# EAGLE schematic embedded-gw (EAGLE 9.6.2)
AUTHOR: Neal Jackson; REV: B; TITLE: Embedded GW

## Sheet 1 of 3
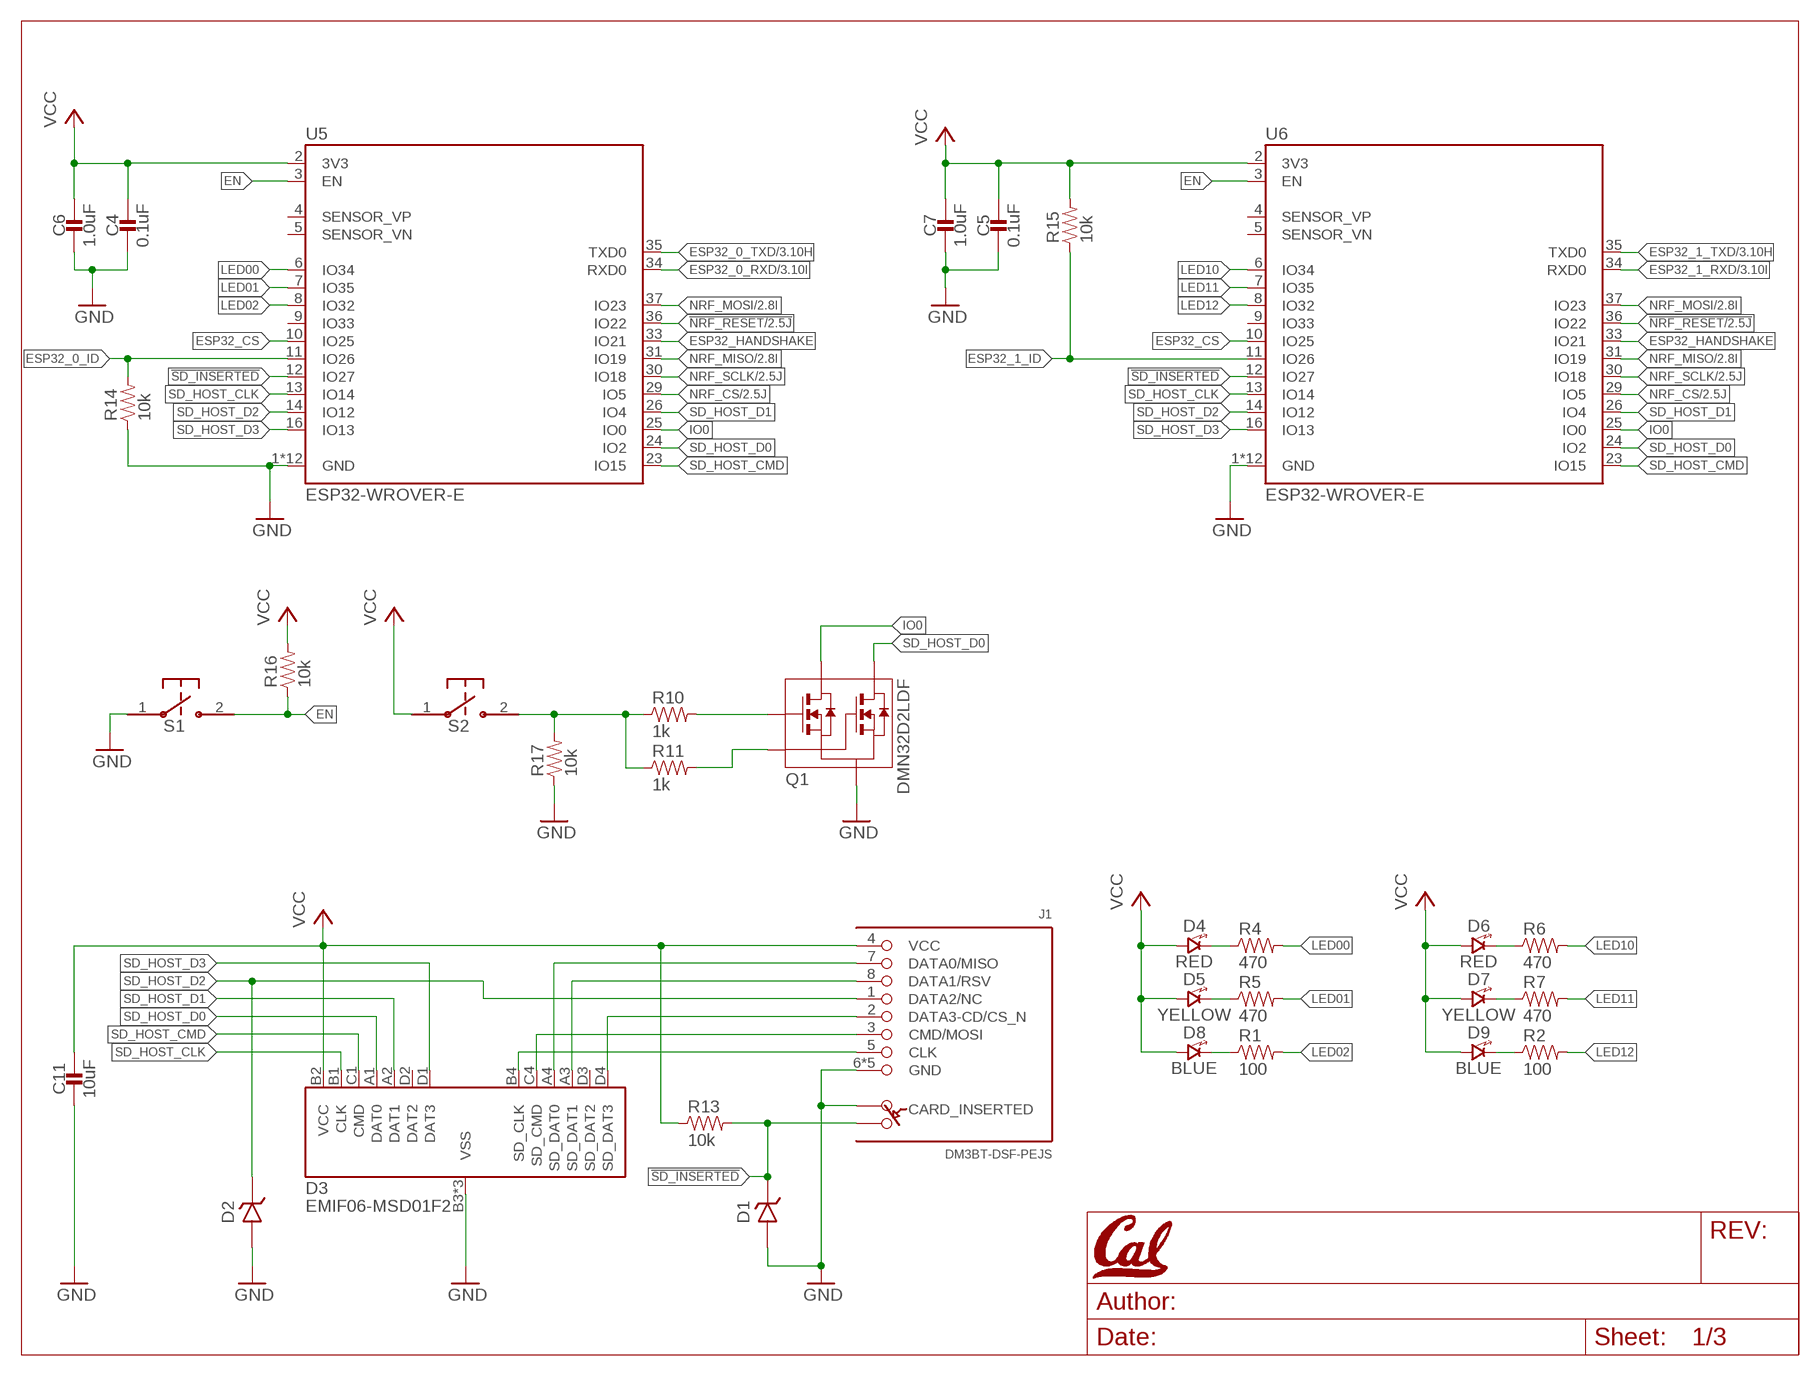
[diagram p0: schematic, sheet 1]
U$1 (LETTER_L_CAL): HEIGHT: 8.5in; WIDTH: 11in

### Parts
C4  0.1uF  CAPACITOR0402_CAP  [0402_CAP]
C5  0.1uF  CAPACITOR0402_CAP  [0402_CAP]
C6  1.0uF  CAPACITOR0402_CAP  [0402_CAP]
C7  1.0uF  CAPACITOR0402_CAP  [0402_CAP]
C11  10uF  CAPACITOR0805_CAP  [0805_CAP]
D1  DIODE_ZENER0201  [0201_DIODE]
D2  DIODE_ZENER0201  [0201_DIODE]
D3  EMIF06-MSD01F2  [BGA16C50P4X4_192X192X65N]
D4  RED  LED0603  [LED-0603]
D5  YELLOW  LED0603  [LED-0603]
D6  RED  LED0603  [LED-0603]
D7  YELLOW  LED0603  [LED-0603]
D8  BLUE  LED0603  [LED-0603]
D9  BLUE  LED0603  [LED-0603]
J1  DM3BT-DSF-PEJS  [HRS_DM3BT-DSF-PEJS]
Q1  DMN32D2LDF  [SOT353]
R1  100  RESISTOR0402_RES  [0402_RES]
R2  100  RESISTOR0402_RES  [0402_RES]
R4  470  RESISTOR0402_RES  [0402_RES]
R5  470  RESISTOR0402_RES  [0402_RES]
R6  470  RESISTOR0402_RES  [0402_RES]
R7  470  RESISTOR0402_RES  [0402_RES]
R10  1k  RESISTOR0402_RES  [0402_RES]
R11  1k  RESISTOR0402_RES  [0402_RES]
R13  10k  RESISTOR0402_RES  [0402_RES]
R14  10k  RESISTOR0402_RES  [0402_RES]
R15  10k  RESISTOR0402_RES  [0402_RES]
R16  10k  RESISTOR0402_RES  [0402_RES]
R17  10k  RESISTOR0402_RES  [0402_RES]
S1  B3U-1000P  [B3U-1000P]
S2  B3U-1000P  [B3U-1000P]
U5  ESP32-WROVER-E  [ESP32-WROVER-E]
U6  ESP32-WROVER-E  [ESP32-WROVER-E]

### Nets
!NRF_RESET: U5.36(IO22) U6.36(IO22) ; also sheet 2
!SD_INSERTED: D1.P$1(CATHODE) J1.SW-B(B) R13.2 U5.12(IO27) U6.12(IO27)
EN: R16.1 S1.2 U5.3(EN) U6.3(EN)
ESP32_0_ID: R14.2 U5.11(IO26)
ESP32_0_RXD: U5.34(RXD0) ; also sheet 3
ESP32_0_TXD: U5.35(TXD0) ; also sheet 3
ESP32_1_ID: R15.1 U6.11(IO26)
ESP32_1_RXD: U6.34(RXD0) ; also sheet 3
ESP32_1_TXD: U6.35(TXD0) ; also sheet 3
ESP32_CS: U5.10(IO25) U6.10(IO25)
ESP32_HANDSHAKE: U5.33(IO21) U6.33(IO21)
GND: C4.2 C5.2 C6.2 C7.2 C11.P$2 D1.P$2(ANODE) D2.P$2(ANODE) D3.B3(VSS) D3.C2(VSS) D3.C3(VSS) J1.6(GND) J1.S1(GND) J1.S2(GND) J1.S3(GND) J1.S4(GND) J1.SW-A(A) Q1.S R14.1 R17.1 S1.1 U5.1(GND) U5.15(GND) U5.38(GND) U5.GND1(GND) U5.GND2(GND) U5.GND3(GND) U5.GND4(GND) U5.GND5(GND) U5.GND6(GND) U5.GND7(GND) U5.GND8(GND) U5.GND9(GND) U6.1(GND) U6.15(GND) U6.38(GND) U6.GND1(GND) U6.GND2(GND) U6.GND3(GND) U6.GND4(GND) U6.GND5(GND) U6.GND6(GND) U6.GND7(GND) U6.GND8(GND) U6.GND9(GND) ; also sheet 2,3
IO0: Q1.D1 U5.25(IO0) U6.25(IO0)
LED00: R4.2 U5.6(IO34)
LED01: R5.2 U5.7(IO35)
LED02: R1.2 U5.8(IO32)
LED10: R6.2 U6.6(IO34)
LED11: R7.2 U6.7(IO35)
LED12: R2.2 U6.8(IO32)
N$1: Q1.G1 R10.2
N$4: Q1.G2 R11.2
N$5: R10.1 R11.1 R17.2 S2.2
N$6: D3.C4(SD_CMD) J1.3(CMD/MOSI)
N$8: D3.A4(SD_DAT0) J1.7(DATA0/MISO)
N$9: D3.A3(SD_DAT1) J1.8(DATA1/RSV)
N$11: D3.D4(SD_DAT3) J1.2(DATA3-CD/CS_N)
N$12: D4.C(CATHODE) R4.1
N$13: D3.B4(SD_CLK) J1.5(CLK)
N$14: D5.C(CATHODE) R5.1
N$15: D8.C(CATHODE) R1.1
N$19: D6.C(CATHODE) R6.1
N$20: D7.C(CATHODE) R7.1
N$21: D9.C(CATHODE) R2.1
NRF_CS: U5.29(IO5) U6.29(IO5) ; also sheet 2
NRF_MISO: U5.31(IO19) U6.31(IO19) ; also sheet 2
NRF_MOSI: U5.37(IO23) U6.37(IO23) ; also sheet 2
NRF_SCLK: U5.30(IO18) U6.30(IO18) ; also sheet 2
SD_HOST_CLK: D3.B1(CLK) U5.13(IO14) U6.13(IO14)
SD_HOST_CMD: D3.C1(CMD) U5.23(IO15) U6.23(IO15)
SD_HOST_D0: D3.A1(DAT0) Q1.D2 U5.24(IO2) U6.24(IO2)
SD_HOST_D1: D3.A2(DAT1) U5.26(IO4) U6.26(IO4)
SD_HOST_D2: D2.P$1(CATHODE) J1.1(DATA2/NC) U5.14(IO12) U6.14(IO12)
SD_HOST_D3: D3.D1(DAT3) U5.16(IO13) U6.16(IO13)
VCC: C4.1 C5.1 C6.1 C7.1 C11.P$1 D3.B2(VCC) D4.A(ANODE) D5.A(ANODE) D6.A(ANODE) D7.A(ANODE) D8.A(ANODE) D9.A(ANODE) J1.4(VCC) R13.1 R15.2 R16.2 S2.1 U5.2(3V3) U6.2(3V3) ; also sheet 2,3
Unconnected: D3.D2(DAT2) D3.D3(SD_DAT2) U5.4(SENSOR_VP) U5.5(SENSOR_VN) U5.9(IO33) U6.4(SENSOR_VP) U6.5(SENSOR_VN) U6.9(IO33)

## Sheet 2 of 3
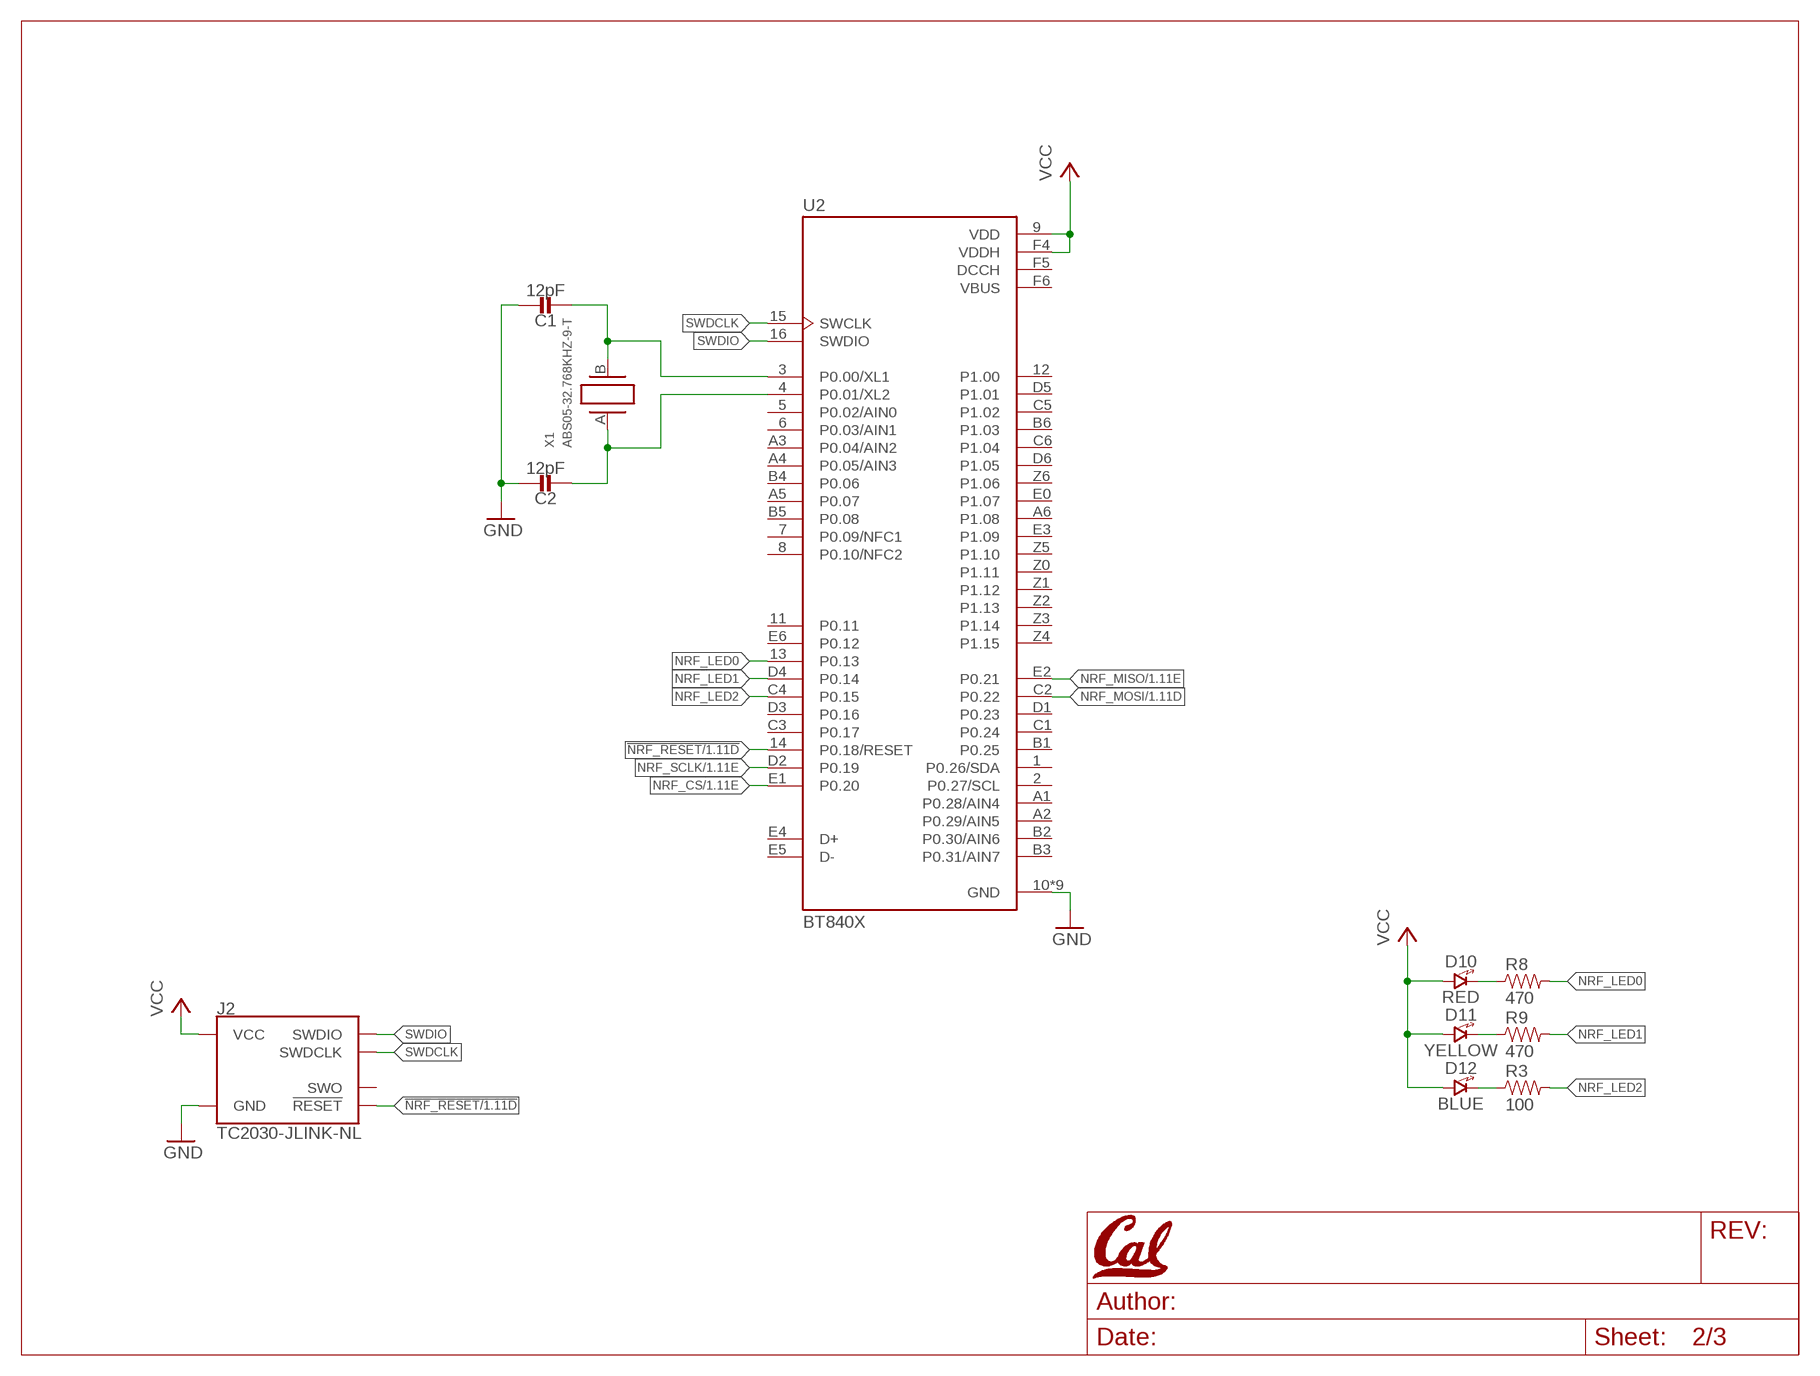
[diagram p1: schematic, sheet 2]
U$2 (LETTER_L_CAL): HEIGHT: 8.5in; WIDTH: 11in

### Parts
C1  12pF  CAPACITOR0402_CAP  [0402_CAP]
C2  12pF  CAPACITOR0402_CAP  [0402_CAP]
D10  RED  LED0603  [LED-0603]
D11  YELLOW  LED0603  [LED-0603]
D12  BLUE  LED0603  [LED-0603]
J2  TC2030-JLINK-NL  [TC2030-IDC-NL]
R3  100  RESISTOR0402_RES  [0402_RES]
R8  470  RESISTOR0402_RES  [0402_RES]
R9  470  RESISTOR0402_RES  [0402_RES]
U2  BT840X  [XCVR_BT840X]
X1  ABS05-32.768KHZ-9-T  [ABS05]

### Nets
!NRF_RESET: J2.3(!RESET) U2.14(P0.18/RESET) ; also sheet 1
GND: C1.1 C2.1 J2.5(GND) U2.10(GND) U2.A0(GND) U2.B0(GND) U2.C0(GND) U2.D0(GND) U2.F0(GND) U2.F1(GND) U2.F2(GND) U2.F3(GND) ; also sheet 1,3
N$2: C1.2 U2.3(P0.00/XL1) X1.B
N$3: C2.2 U2.4(P0.01/XL2) X1.A
N$22: D10.C(CATHODE) R8.1
N$23: D11.C(CATHODE) R9.1
N$24: D12.C(CATHODE) R3.1
NC: U2.F6(VBUS)
NRF_CS: U2.E1(P0.20) ; also sheet 1
NRF_LED0: R8.2 U2.13(P0.13)
NRF_LED1: R9.2 U2.D4(P0.14)
NRF_LED2: R3.2 U2.C4(P0.15)
NRF_MISO: U2.E2(P0.21) ; also sheet 1
NRF_MOSI: U2.C2(P0.22) ; also sheet 1
NRF_SCLK: U2.D2(P0.19) ; also sheet 1
SWDCLK: J2.4(SWDCLK) U2.15(SWCLK)
SWDIO: J2.2(SWDIO) U2.16(SWDIO)
VCC: D10.A(ANODE) D11.A(ANODE) D12.A(ANODE) J2.1(VCC) U2.9(VDD) U2.F4(VDDH) ; also sheet 1,3
Unconnected: J2.6(SWO) U2.1(P0.26/SDA) U2.2(P0.27/SCL) U2.5(P0.02/AIN0) U2.6(P0.03/AIN1) U2.7(P0.09/NFC1) U2.8(P0.10/NFC2) U2.11(P0.11) U2.12(P1.00) U2.A1(P0.28/AIN4) U2.A2(P0.29/AIN5) U2.A3(P0.04/AIN2) U2.A4(P0.05/AIN3) U2.A5(P0.07) U2.A6(P1.08) U2.B1(P0.25) U2.B2(P0.30/AIN6) U2.B3(P0.31/AIN7) U2.B4(P0.06) U2.B5(P0.08) U2.B6(P1.03) U2.C1(P0.24) U2.C3(P0.17) U2.C5(P1.02) U2.C6(P1.04) U2.D1(P0.23) U2.D3(P0.16) U2.D5(P1.01) U2.D6(P1.05) U2.E0(P1.07) U2.E3(P1.09) U2.E4(D+) U2.E5(D-) U2.E6(P0.12) U2.Z0(P1.11) U2.Z1(P1.12) U2.Z2(P1.13) U2.Z3(P1.14) U2.Z4(P1.15) U2.Z5(P1.10) U2.Z6(P1.06)

## Sheet 3 of 3
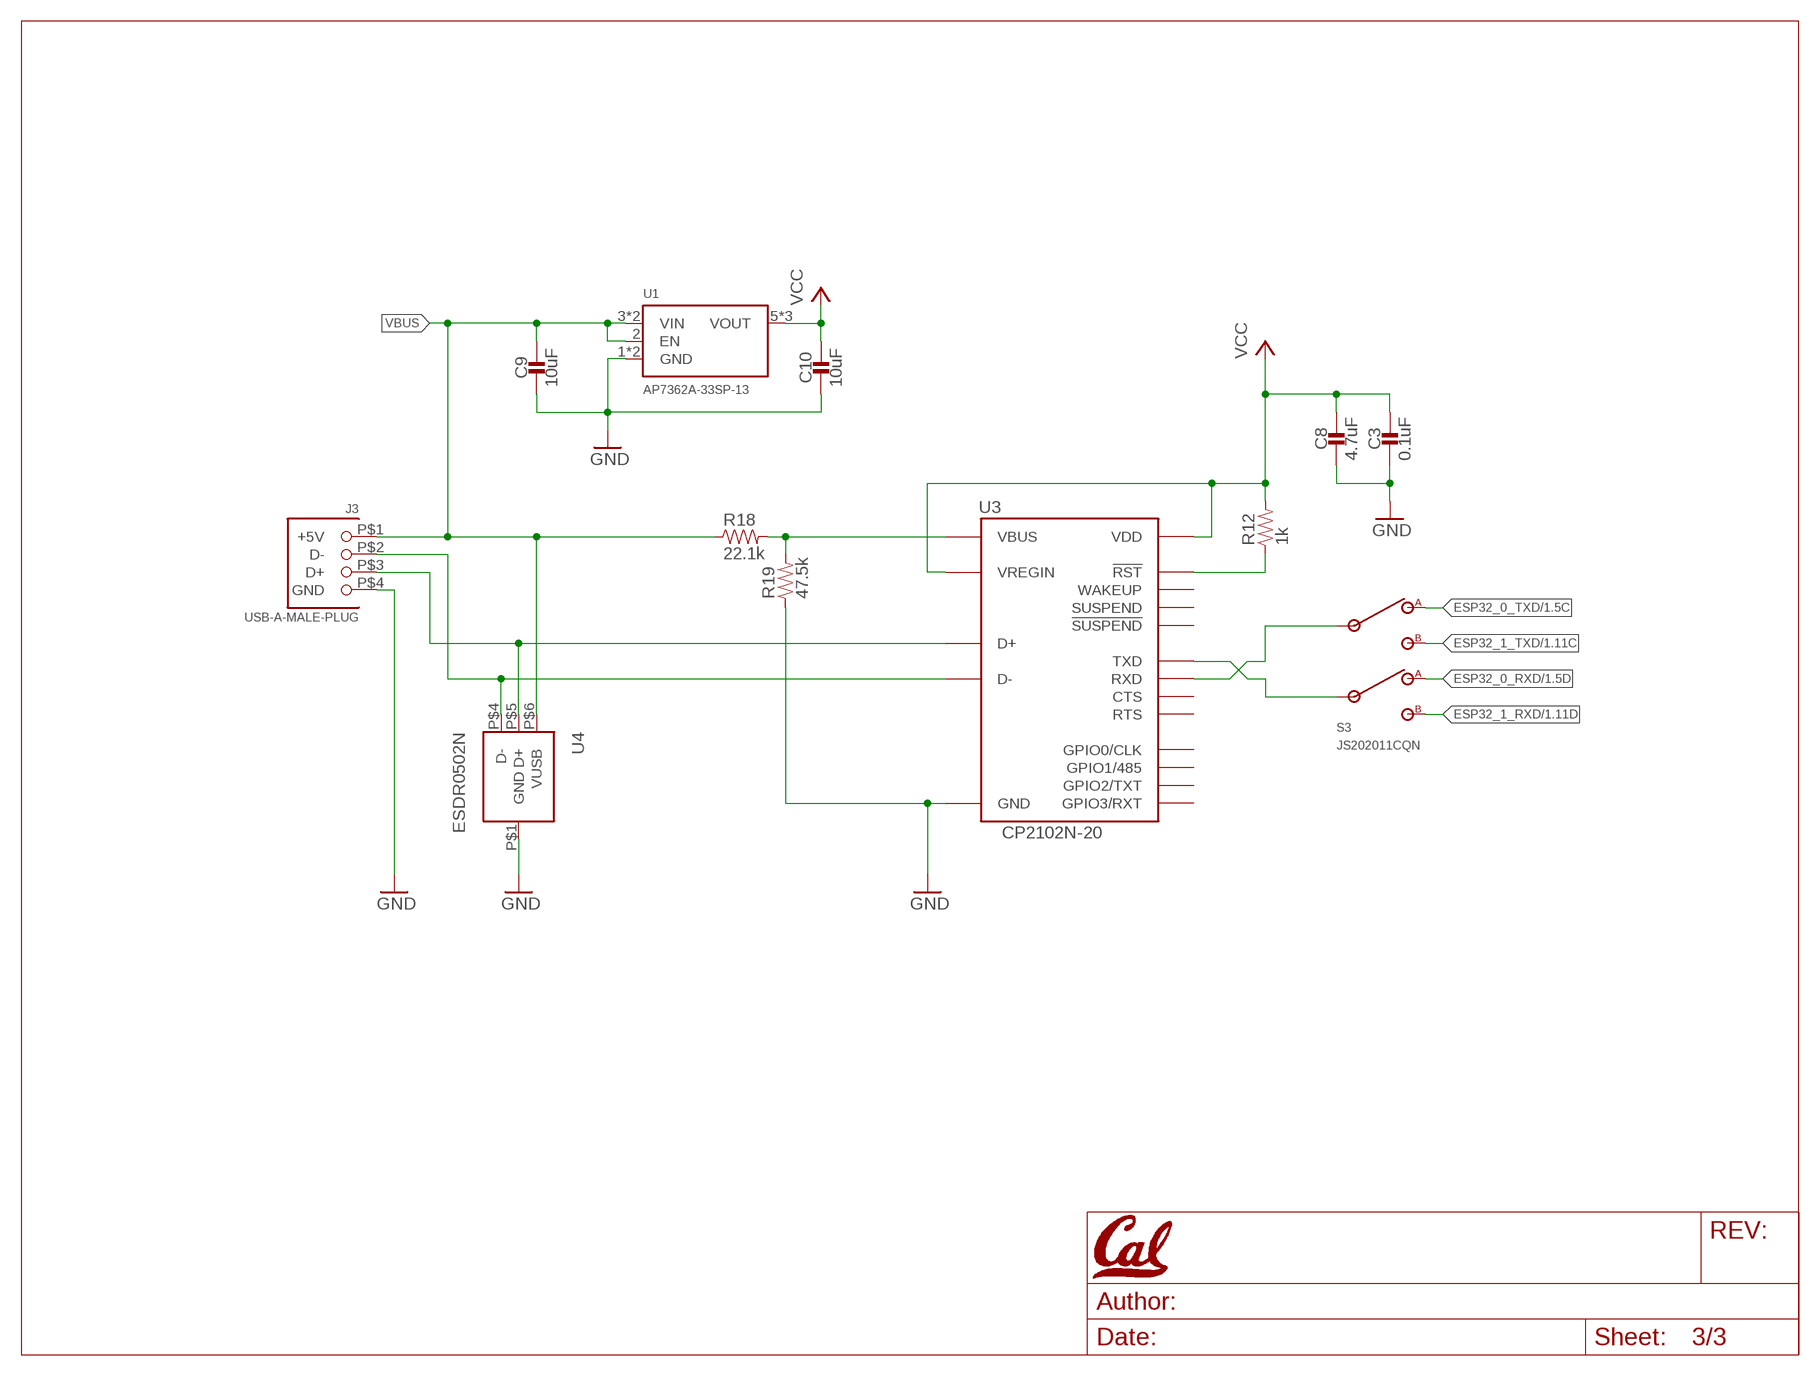
[diagram p2: schematic, sheet 3]
U$3 (LETTER_L_CAL): HEIGHT: 8.5in; WIDTH: 11in

### Parts
C3  0.1uF  CAPACITOR0402_CAP  [0402_CAP]
C8  4.7uF  CAPACITOR0603_CAP  [0603_CAP]
C9  10uF  CAPACITOR0805_CAP  [0805_CAP]
C10  10uF  CAPACITOR0805_CAP  [0805_CAP]
J3  USB-A-MALE-PLUG  [USB_A_MALE_PLUG_CUI_UP2-AH]
R12  1k  RESISTOR0402_RES  [0402_RES]
R18  22.1k  RESISTOR0402_RES  [0402_RES]
R19  47.5k  RESISTOR0402_RES  [0402_RES]
S3  JS202011CQN  [JS202011CQN]
U1  AP7362A-33SP-13  [SO-8EP]
U3  CP2102N-20  [QFN-20-3MM]
U4  ESDR0502N  [UDFN-6]

### Nets
D+: J3.P$3(D+) U3.4(D+) U4.P$5(D+)
D-: J3.P$2(D-) U3.5(D-) U4.P$4(D-)
ESP32_0_RXD: S3.1(A2) ; also sheet 1
ESP32_0_TXD: S3.4(A1) ; also sheet 1
ESP32_1_RXD: S3.3(B2) ; also sheet 1
ESP32_1_TXD: S3.6(B1) ; also sheet 1
GND: C3.2 C8.2 C9.P$2 C10.P$2 J3.P$4(GND) R19.1 U1.1(GND) U1.PAD(GND) U3.3(GND) U3.12(GND) U3.P$1(GND) U4.P$1(GND) ; also sheet 1,2
N$7: R12.1 U3.9(!RST)
N$10: R18.2 R19.2 U3.8(VBUS)
RXD: S3.2(I2) U3.18(TXD)
TXD: S3.5(I1) U3.17(RXD)
VBUS: C9.P$1 J3.P$1(+5V) R18.1 U1.2(EN) U1.3(VIN) U1.4(VIN) U4.P$6(VUSB)
VCC: C3.1 C8.1 C10.P$1 R12.2 U1.5(VOUT) U1.6(VOUT) U1.7(VOUT) U3.6(VDD) U3.7(VREGIN) ; also sheet 1,2
Unconnected: U3.1(GPIO1/485) U3.2(GPIO0/CLK) U3.11(!SUSPEND) U3.13(WAKEUP) U3.14(SUSPEND) U3.15(CTS) U3.16(RTS) U3.19(GPIO3/RXT) U3.20(GPIO2/TXT)

## Power pins joined to a net without a drawn wire
DCCH: U2.F5(DCCH)

## Library data of the parts
C1 C2 = passives:CAPACITOR: SMD Capacitor; DIGIKEY: 490-GCM1555C1H120GA16DCT-ND; MPN: GCM1555C1H120GA16D
C3-C5 = passives:CAPACITOR: SMD Capacitor; DIGIKEY: 1276-1511-1-ND; MPN: CL05B104KQ5NNNC
C6 C7 = passives:CAPACITOR: SMD Capacitor; DIGIKEY: 1276-1010-1-ND; MPN: CL05A105KQ5NNNC
C8 = passives:CAPACITOR: SMD Capacitor; DIGIKEY: 1276-1045-1-ND; MPN: CL10A475KQ8NNNC
C9-C11 = passives:CAPACITOR: SMD Capacitor; DIGIKEY: 1276-2404-1-ND; MPN: CL21A106KQCLNNC
D1 D2 = passives:DIODE_ZENER; DIGIKEY: ESD7381MUT5GOSCT-ND; MPN: ESD7381MUT5G
D3 = passives:EMIF06-MSD01F2: Mini and micro SD Card - EMI filtering and 25 kV ESD protection; DIGIKEY: 497-5903-1-ND; MANUFACTURER: STMicroelectronics; MPN: EMIF06-MSD01F2
D4 D6 D10 = leds:LED: LED; DIGIKEY: 160-1830-1-ND; MPN: LTST-C193KRKT-5A
D5 D7 D11 = leds:LED: LED; DIGIKEY: 160-1831-1-ND; MPN: LTST-C193KSKT-5A
D8 D9 D12 = leds:LED: LED; DIGIKEY: 160-1827-1-ND; MPN: LTST-C193TBKT-5A
J1 = connector:DM3BT-DSF-PEJS: 10 (8 + 2) Position Card Connector Secure Digital - microSD™ Surface Mount, Right Angle Gold Check prices <https://pricing.snapeda.com/parts/DM3BT-DSF-PEJS/Hirose%20Connector/view-part?ref=eda>; DIGIKEY: HR1942TR-ND; MANUFACTURER: Hirose Connector; MPN: DM3BT-DSF-PEJS
J2 = connector:TC2030-JLINK
J3 = connector:USB-A-MALE-PLUG: USB A Male plug connector; DIGIKEY: 102-3996-ND; MANUFACTURER: CUI; MPN: UP2-AH-1-TH
Q1 = fets:DMN32D2LDF: Common source dual n-channel mosfet; DIGIKEY: DMN32D2LDF-7DICT-ND; MANUFACTURER: Diodes Incorporated; MPN: DMN32D2LDF-7
R1-R3 = passives:RESISTOR: Resistor Basic schematic elements and footprints for 0201, 0402, 0603, 1206, and PTH resistors.; DIGIKEY: 311-100JRCT-ND; MPN: RC0402JR-07100RL
R4-R9 = passives:RESISTOR: Resistor Basic schematic elements and footprints for 0201, 0402, 0603, 1206, and PTH resistors.; DIGIKEY: 311-470LRCT-ND; MPN: RC0402FR-07470RL
R10-R12 = passives:RESISTOR: Resistor Basic schematic elements and footprints for 0201, 0402, 0603, 1206, and PTH resistors.; DIGIKEY: RMCF0402JT1K00CT-ND; MPN: RMCF0402JT1K00
R13-R17 = passives:RESISTOR: Resistor Basic schematic elements and footprints for 0201, 0402, 0603, 1206, and PTH resistors.; DIGIKEY: RMCF0402JT10K0CT-ND; MPN: RMCF0402JT10K0
R18 = passives:RESISTOR: Resistor Basic schematic elements and footprints for 0201, 0402, 0603, 1206, and PTH resistors.; DIGIKEY: 311-22.1KLRCT-ND; MPN: RC0402FR-0722K1L
R19 = passives:RESISTOR: Resistor Basic schematic elements and footprints for 0201, 0402, 0603, 1206, and PTH resistors.; DIGIKEY: 13-RT0402FRE0722K1LCT-ND; MPN: RT0402FRE0722K1L
S1 S2 = switches:B3U: Switch; DIGIKEY: SW1020CT-ND; MANUFACTURER: Omron; MPN: B3U-1000P
S3 = switches:JS202011CQN: DPDT through hole; DIGIKEY: 401-2001-ND; MANUFACTURER: C&K; MPN: JS202011CQN
U1 = chips:AP7362: The AP7362 is a 1.5A adjustable/fixed output voltage linear regulator with ultra-low dropout; DIGIKEY: AP7362A-33SP-13DICT-ND; MANUFACTURER: Diodes Incorporated; MPN: AP7362A-33SP-13
U2 = BT840X:BT840X: 802.15.4, Bluetooth Bluetooth v5.0, Thread, Zigbee® Transceiver Module 2.4GHz PCB Trace Surface Mou Check prices <https://pricing.snapeda.com/parts/BT840X/Fanstel%20Corp./view-part?ref=eda>; DIGIKEY: 1914-BT840XCT-ND; MANUFACTURER: Fanstel Corp.; MPN: BT840X
U3 = chips:CP2102N-20: A cheap, simple USB to UART adapter; DIGIKEY: 336-3692-ND; MANUFACTURER: SiLabs; MPN: CP2102N-A01-GQFN20
U4 = chips:ESDR0502N; DIGIKEY: ESDR0502NMUTBGOSCT-ND; MPN: ESDR0502NMUTBG
U5 U6 = chips:ESP32-WROVER-E; DIGIKEY: 1965-ESP32-WROVER-E(8MB)CT-ND; MANUFACTURER: Espressif Systems; MPN: ESP32-WROVER-E (8MB)
X1 = crystals:ABS05-32.768KHZ: 32.768kHz Crystal; DIGIKEY: 535-11897-1-ND; MANUFACTURER: Abracon; MPN: ABS05-32.768KHZ-9-T